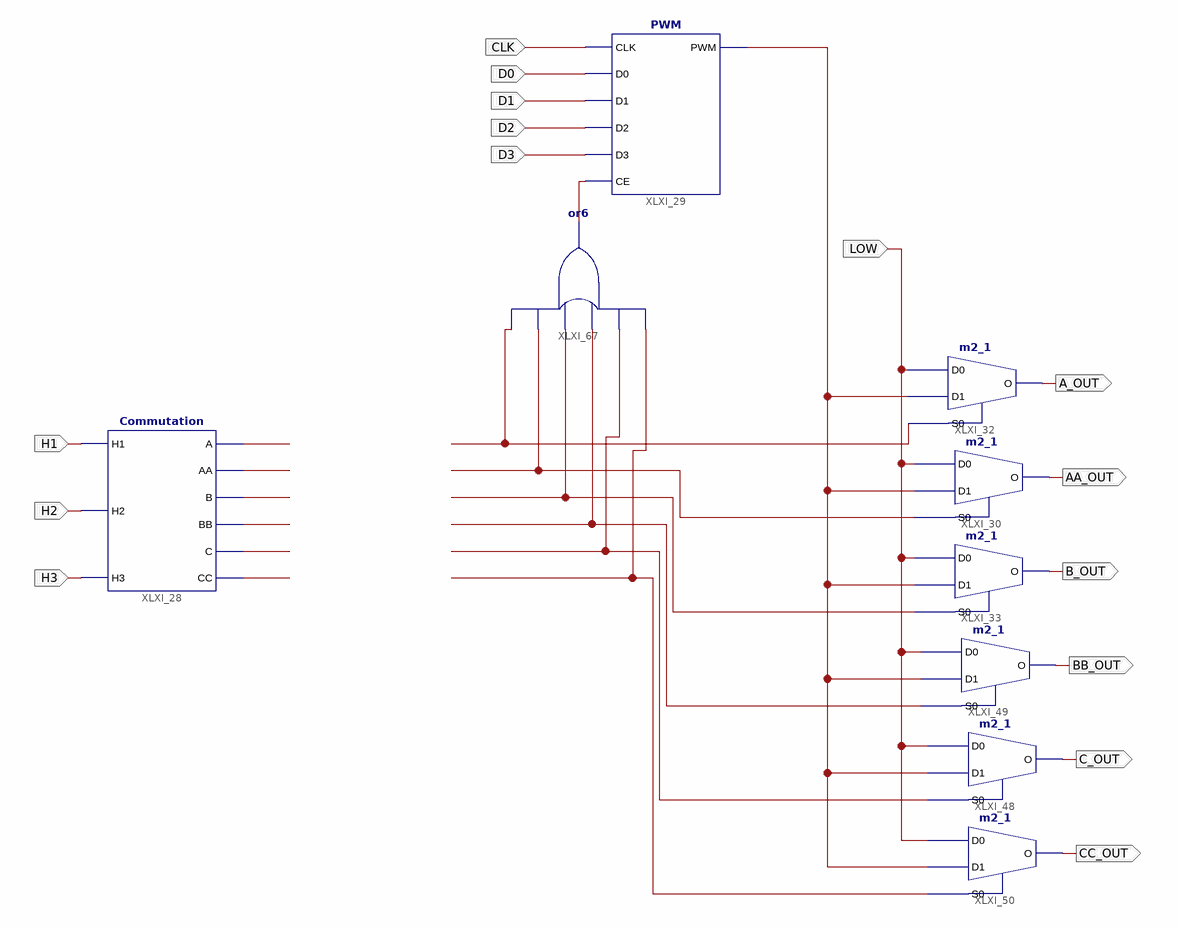
[diagram p0: schematic sheet 1]
// Xilinx ISE schematic Akash_Driver_v1.sch (spartan3e) as structural Verilog: 9 symbols, 15 ports
module Akash_Driver_v1 (
  input  LOW,
  input  H3,
  input  H2,
  input  H1,
  input  D3,
  input  D2,
  input  D1,
  input  D0,
  input  CLK,
  output A_OUT,
  output AA_OUT,
  output B_OUT,
  output CC_OUT,
  output C_OUT,
  output BB_OUT
);

  wire XLXN_63, XLXN_64, XLXN_65, XLXN_66, XLXN_67, XLXN_68, XLXN_111, XLXN_113, XLXN_114, XLXN_115,
       XLXN_116, XLXN_123, XLXN_124, XLXN_128;

  Commutation XLXI_28 (
    .H1(H1), .H2(H2), .H3(H3), .A(XLXN_63), .AA(XLXN_64), .B(XLXN_65), .BB(XLXN_66), .C(XLXN_67), .CC(XLXN_68));
  m2_1 XLXI_30 (.D0(LOW), .D1(XLXN_128), .S0(XLXN_111), .O(AA_OUT));
  m2_1 XLXI_32 (.D0(LOW), .D1(XLXN_128), .S0(XLXN_124), .O(A_OUT));
  m2_1 XLXI_33 (.D0(LOW), .D1(XLXN_128), .S0(XLXN_113), .O(B_OUT));
  m2_1 XLXI_49 (.D0(LOW), .D1(XLXN_128), .S0(XLXN_114), .O(BB_OUT));
  m2_1 XLXI_50 (.D0(LOW), .D1(XLXN_128), .S0(XLXN_116), .O(CC_OUT));
  m2_1 XLXI_48 (.D0(LOW), .D1(XLXN_128), .S0(XLXN_115), .O(C_OUT));
  PWM XLXI_29 (.CLK(CLK), .D0(D0), .D1(D1), .D2(D2), .D3(D3), .CE(XLXN_123), .PWM(XLXN_128));
  or XLXI_67 (XLXN_123, XLXN_116, XLXN_115, XLXN_114, XLXN_113, XLXN_111, XLXN_124);
endmodule
